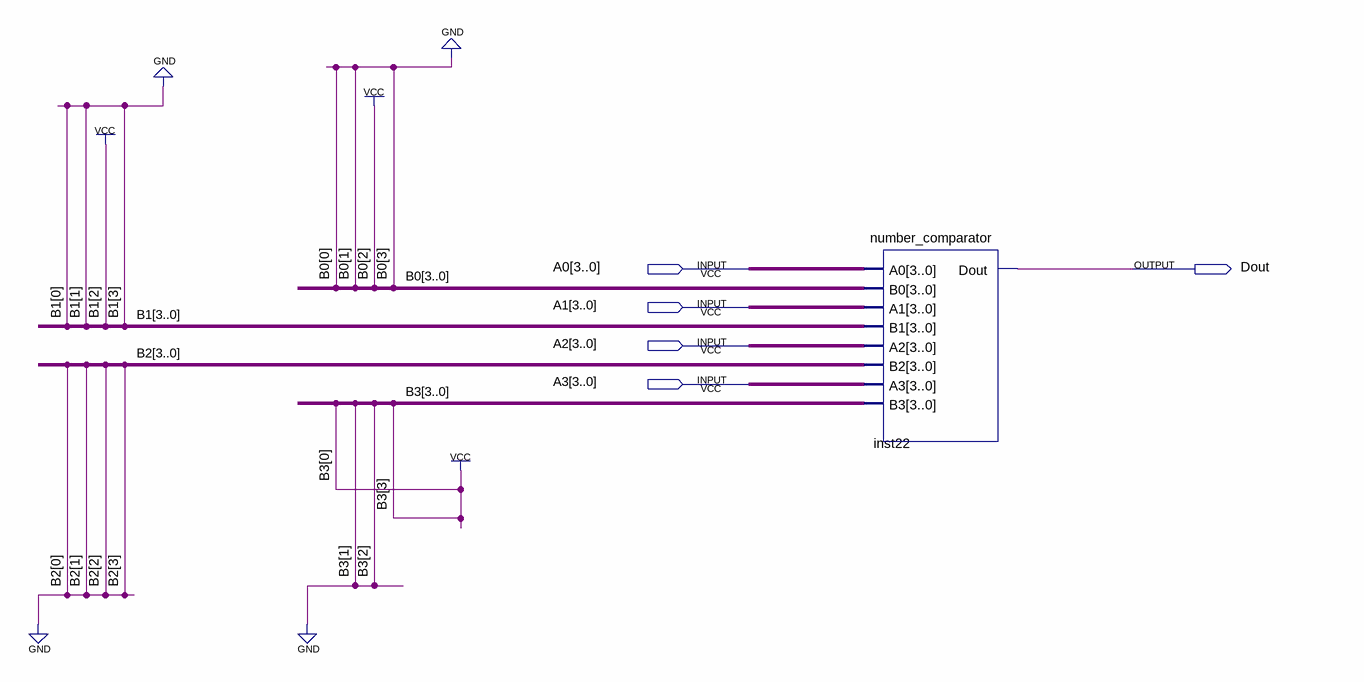
[diagram p0: schematic sheet]
// Quartus schematic number_comparator_test.bdf as structural Verilog: 1 symbols, 5 pins
module number_comparator_test (
  input  [3:0] A0,
  input  [3:0] A1,
  input  [3:0] A2,
  input  [3:0] A3,
  output Dout
);

  number_comparator inst22 (
    .A0(A0), .B0(4'b0100), .A1(A1), .B1(4'b0100), .A2(A2), .B2(4'b0000), .A3(A3), .B3(4'b1001), .Dout(Dout));
endmodule
